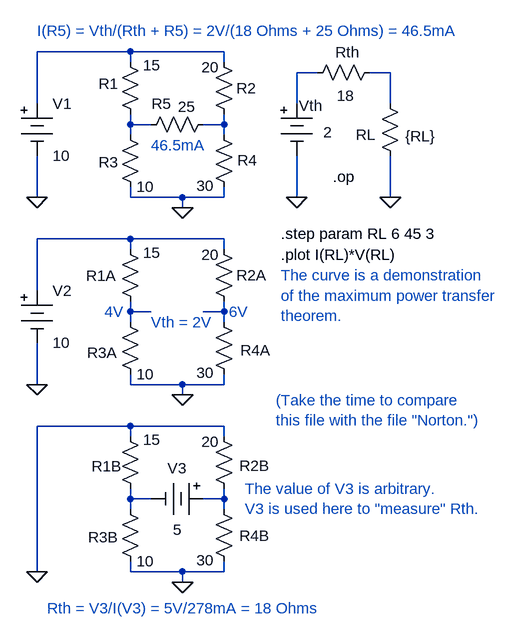
[diagram p0: schematic Thevenin.asc]
Thevenin.asc, the LTspice schematic file:
Version 4
SHEET 1 880 904
WIRE 96 -160 -48 -160
WIRE 240 -160 96 -160
WIRE 96 -144 96 -160
WIRE 240 -144 240 -160
WIRE 384 -128 352 -128
WIRE 496 -128 464 -128
WIRE -48 -80 -48 -160
WIRE 352 -80 352 -128
WIRE 496 -80 496 -128
WIRE 96 -48 96 -64
WIRE 128 -48 96 -48
WIRE 240 -48 240 -64
WIRE 240 -48 208 -48
WIRE 96 -32 96 -48
WIRE 240 -32 240 -48
WIRE -48 64 -48 0
WIRE 96 64 96 48
WIRE 176 64 96 64
WIRE 240 64 240 48
WIRE 240 64 176 64
WIRE 352 64 352 0
WIRE 496 64 496 0
WIRE 176 80 176 64
WIRE 96 128 -48 128
WIRE 240 128 96 128
WIRE 96 144 96 128
WIRE 240 144 240 128
WIRE -48 208 -48 128
WIRE 96 240 96 224
WIRE 128 240 96 240
WIRE 240 240 240 224
WIRE 240 240 208 240
WIRE 96 256 96 240
WIRE 240 256 240 240
WIRE -48 352 -48 288
WIRE 96 352 96 336
WIRE 176 352 96 352
WIRE 240 352 240 336
WIRE 240 352 176 352
WIRE 176 368 176 352
WIRE 96 416 -48 416
WIRE 240 416 96 416
WIRE 96 432 96 416
WIRE 240 432 240 416
WIRE 96 528 96 512
WIRE 128 528 96 528
WIRE 240 528 240 512
WIRE 240 528 208 528
WIRE 96 544 96 528
WIRE 240 544 240 528
WIRE -48 640 -48 416
WIRE 96 640 96 624
WIRE 176 640 96 640
WIRE 240 640 240 624
WIRE 240 640 176 640
WIRE 176 656 176 640
FLAG -48 64 0
FLAG 176 80 0
FLAG -48 352 0
FLAG 176 368 0
FLAG -48 640 0
FLAG 176 656 0
FLAG 352 64 0
FLAG 496 64 0
SYMBOL res 80 -160 R0
WINDOW 0 -33 49 Left 0
WINDOW 3 35 21 Left 0
SYMATTR InstName R1
SYMATTR Value 15
SYMBOL res 224 -160 R0
WINDOW 0 35 56 Left 0
WINDOW 3 -19 24 Left 0
SYMATTR InstName R2
SYMATTR Value 20
SYMBOL res 80 -48 R0
WINDOW 0 -33 58 Left 0
WINDOW 3 25 96 Left 0
SYMATTR InstName R3
SYMATTR Value 10
SYMBOL res 224 -48 R0
WINDOW 0 37 55 Left 0
WINDOW 3 -26 94 Left 0
SYMATTR InstName R4
SYMATTR Value 30
SYMBOL res 224 -64 R90
WINDOW 0 0 80 VBottom 0
WINDOW 3 -27 41 VTop 0
SYMATTR InstName R5
SYMATTR Value 25
SYMBOL Misc\\battery -48 -96 R0
WINDOW 123 0 0 Left 0
WINDOW 39 0 0 Left 0
SYMATTR InstName V1
SYMATTR Value 10
SYMBOL res 80 128 R0
WINDOW 0 -52 57 Left 0
WINDOW 3 35 21 Left 0
SYMATTR InstName R1A
SYMATTR Value 15
SYMBOL res 224 128 R0
WINDOW 0 35 56 Left 0
WINDOW 3 -19 24 Left 0
SYMATTR InstName R2A
SYMATTR Value 20
SYMBOL res 80 240 R0
WINDOW 0 -51 63 Left 0
WINDOW 3 25 96 Left 0
SYMATTR InstName R3A
SYMATTR Value 10
SYMBOL res 224 240 R0
WINDOW 0 41 59 Left 0
WINDOW 3 -26 94 Left 0
SYMATTR InstName R4A
SYMATTR Value 30
SYMBOL Misc\\battery -48 192 R0
WINDOW 123 0 0 Left 0
WINDOW 39 0 0 Left 0
SYMATTR InstName V2
SYMATTR Value 10
SYMBOL res 80 416 R0
WINDOW 0 -44 62 Left 0
WINDOW 3 35 21 Left 0
SYMATTR InstName R1B
SYMATTR Value 15
SYMBOL res 224 416 R0
WINDOW 0 40 61 Left 0
WINDOW 3 -19 24 Left 0
SYMATTR InstName R2B
SYMATTR Value 20
SYMBOL res 80 528 R0
WINDOW 0 -49 59 Left 0
WINDOW 3 25 96 Left 0
SYMATTR InstName R3B
SYMATTR Value 10
SYMBOL res 224 528 R0
WINDOW 0 40 57 Left 0
WINDOW 3 -26 94 Left 0
SYMATTR InstName R4B
SYMATTR Value 30
SYMBOL Misc\\battery 224 528 R90
WINDOW 0 -32 56 VBottom 0
WINDOW 3 32 56 VTop 0
WINDOW 123 0 0 Left 0
WINDOW 39 0 0 Left 0
SYMATTR InstName V3
SYMATTR Value 5
SYMBOL res 480 -96 R0
WINDOW 0 -37 64 Left 0
WINDOW 3 39 66 Left 0
SYMATTR InstName RL
SYMATTR Value {RL}
SYMBOL res 480 -144 R90
WINDOW 0 0 50 VBottom 0
WINDOW 3 36 53 VTop 0
SYMATTR InstName Rth
SYMATTR Value 18
SYMBOL Misc\\battery 352 -96 R0
WINDOW 123 0 0 Left 0
WINDOW 39 0 0 Left 0
WINDOW 0 3 19 Left 0
WINDOW 3 41 60 Left 0
SYMATTR InstName Vth
SYMATTR Value 2
TEXT 128 -16 Left 0 ;46.5mA
TEXT 56 240 Left 0 ;4V
TEXT 248 240 Left 0 ;6V
TEXT 128 256 Left 0 ;Vth = 2V
TEXT -32 696 Left 0 ;Rth = V3/I(V3) = 5V/278mA = 18 Ohms
TEXT -48 -192 Left 0 ;I(R5) = Vth/(Rth + R5) = 2V/(18 Ohms + 25 Ohms) = 46.5mA
TEXT 272 512 Left 0 ;The value of V3 is arbitrary.\nV3 is used here to "measure" Rth.
TEXT 408 32 Left 0 !.op
TEXT 328 120 Left 0 !.step param RL 6 45 3
TEXT 328 152 Left 0 !.plot I(RL)*V(RL)
TEXT 328 184 Left 0 ;The curve is a demonstration\nof the maximum power transfer\ntheorem.
TEXT 320 376 Left 0 ;(Take the time to compare\nthis file with the file "Norton.")

The netlist it stands for:
* Thevenin.asc
R1 N001 N004 15
R2 N001 N005 20
R3 N004 0 10
R4 N005 0 30
R5 N005 N004 25
V1 N001 0 10
R1A N006 N007 15
R2A N006 N008 20
R3A N007 0 10
R4A N008 0 30
V2 N006 0 10
R1B 0 N009 15
R2B 0 N010 20
R3B N009 0 10
R4B N010 0 30
V3 N010 N009 5
RL N003 0 {RL}
Rth N003 N002 18
Vth N002 0 2
* 46.5mA
* 4V
* 6V
* Vth = 2V
* Rth = V3/I(V3) = 5V/278mA = 18 Ohms
* I(R5) = Vth/(Rth + R5) = 2V/(18 Ohms + 25 Ohms) = 46.5mA
* The value of V3 is arbitrary.
* V3 is used here to "measure" Rth.
.op
.step param RL 6 45 3
.plot I(RL)*V(RL)
* The curve is a demonstration
* of the maximum power transfer
* theorem.
* (Take the time to compare
* this file with the file "Norton.")
.backanno
.end